# EAGLE design Shield (EAGLE 7.2.0)
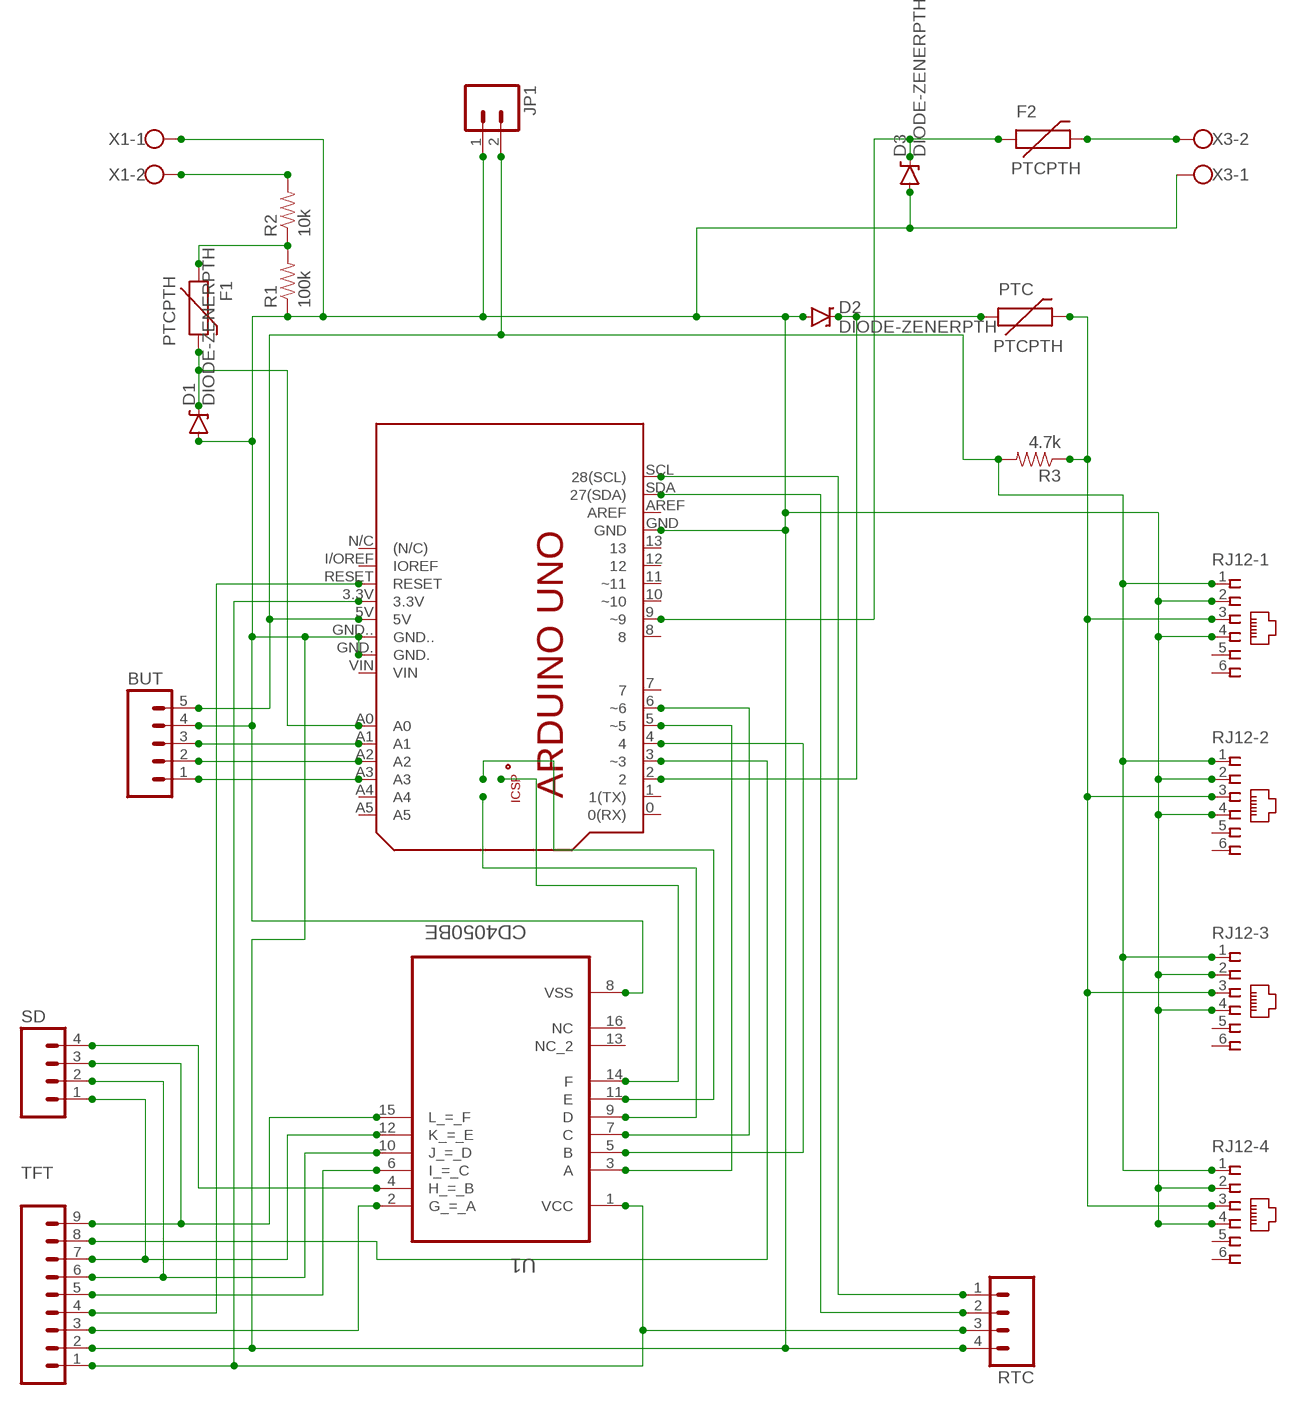
[diagram p0: schematic, sheet 1]

## Parts
BUT  M05PTH_LONGPADS  [1X05_LONGPADS]
D1  DIODE-ZENERPTH  [DIODE-ZENER]
D2  DIODE-ZENERPTH  [DIODE-ZENER]
D3  DIODE-ZENERPTH  [DIODE-ZENER]
F1  PTCPTH  [PTC]
F2  PTCPTH  [PTC]
JP1  M023.5MM  [SCREWTERMINAL-3.5MM-2]
PCB1  ARDUINO_UNO  [ARDUINO_UNO]
PTC  PTCPTH  [PTC]
R1  100k  RESISTORAXIAL-0.3  [AXIAL-0.3]
R2  10k  RESISTORAXIAL-0.3  [AXIAL-0.3]
R3  4.7k  RESISTORAXIAL-0.3  [AXIAL-0.3]
RJ12-1  555165-1  [555165-1]
RJ12-2  555165-1  [555165-1]
RJ12-3  555165-1  [555165-1]
RJ12-4  555165-1  [555165-1]
RTC  M04LONGPADS  [1X04_LONGPADS]
SD  M04LONGPADS  [1X04_LONGPADS]
TFT  M09LONGPADS  [1X09_LONGPADS]
U1  CD4050BE  [DIP254P762X508-16]
X1  W237-102  [W237-102]
X3  W237-102  [W237-102]

## Nets
GND: BUT.4 D1.P$2(A) D2.P$2(A) D3.P$2(A) JP1.1 PCB1.GND PCB1.GND. PCB1.GND.. R1.P$1 RJ12-1.2 RJ12-1.4 RJ12-2.2 RJ12-2.4 RJ12-3.2 RJ12-3.4 RJ12-4.2 RJ12-4.4 RTC.4 TFT.2 U1.8(VSS) X1.1 X3.1
N$1: BUT.3 PCB1.A1
N$2: PTC.P$2 R3.P$1 RJ12-1.3 RJ12-2.3 RJ12-3.3 RJ12-4.3
N$3: PCB1.3.3V RTC.3 TFT.1 U1.1(VCC)
N$4: D2.P$1(C) PCB1.2 PTC.P$1
N$5: PCB1.RESET TFT.4
N$6: SD.4 U1.4(H_=_B)
N$7: PCB1.5(~5) U1.3(A)
N$8: PCB1.6(~6) U1.7(C)
N$9: PCB1.MOSI U1.9(D)
N$10: TFT.3 U1.2(G_=_A)
N$11: TFT.5 U1.6(I_=_C)
N$12: SD.2 TFT.6 U1.10(J_=_D)
N$13: PCB1.3(~3) TFT.8
N$14: SD.1 TFT.7 U1.12(K_=_E)
N$15: SD.3 TFT.9 U1.15(L_=_F)
N$16: PCB1.SCK U1.11(E)
N$17: PCB1.MISO U1.14(F)
N$18: BUT.5 JP1.2 PCB1.5V R3.P$2 RJ12-1.1 RJ12-2.1 RJ12-3.1 RJ12-4.1
N$19: BUT.2 PCB1.A2
N$20: PCB1.4 U1.5(B)
N$21: BUT.1 PCB1.A3
N$22: PCB1.SDA(27(SDA)) RTC.2
N$23: PCB1.SCL(28(SCL)) RTC.1
N$24: F1.P$1 R1.P$2 R2.P$1
N$25: D1.P$1(C) F1.P$2 PCB1.A0
N$26: R2.P$2 X1.2
N$27: F2.P$2 X3.2
N$28: D3.P$1(C) F2.P$1 PCB1.9(~9)
Unconnected: PCB1.0(0(RX)) PCB1.1(1(TX)) PCB1.7 PCB1.8 PCB1.10(~10) PCB1.11(~11) PCB1.12 PCB1.13 PCB1.+5V PCB1.A4 PCB1.A5 PCB1.AREF PCB1.GND_ PCB1.I/OREF(IOREF) PCB1.N/C((N/C)) PCB1.RESET. PCB1.VIN RJ12-1.5 RJ12-1.6 RJ12-2.5 RJ12-2.6 RJ12-3.5 RJ12-3.6 RJ12-4.5 RJ12-4.6 U1.13(NC_2) U1.16(NC)

## Library data of the parts
BUT = SparkFun-Connectors:M05: Header 5 Standard 5-pin 0.1" header. Use with straight break away headers (SKU : PRT-00116), right angle break away headers (PRT-00553), swiss pins (PRT-00743), machine pins (PRT-00117), and female headers (PRT-00115). Molex polarized connector foot print use with SKU : PRT-08230 with associated crimp pins and housings.
D1-D3 = SparkFun-DiscreteSemi:DIODE-ZENER: Zener Diode Production Part - 8199 3.4V Zener Voltage
F1 F2 PTC = SparkFun-PowerIC:PTC: Resettable Fuse PTC Resettable Fuse. Spark Fun Electronics SKU : COM-08357
JP1 = SparkFun-Connectors:M02: Standard 2-pin 0.1" header. Use with - straight break away headers ( PRT-00116) - right angle break away headers (PRT-00553) - swiss pins (PRT-00743) - machine pins (PRT-00117) - female headers (PRT-00115) Molex polarized connector foot print use with: PRT-08233 with associated crimp pins and housings. 2.54_SCREWTERM for use with PRT-10571. 3.5mm Screw Terminal footprints for PRT-08084 5mm Screw Terminal footprints for use with PRT-08432; PROD_ID: CONN-08399
PCB1 = BensCustomLib:ARDUINO_UNO: Device for representing an Arduino Uno board with a footprint in an EAGLE design. Created by Dave Young for Element14. More EAGLE documentation at: http://www.element14.com/community/community/knode/cadsoft_eagle
R1-R3 = SparkFun-Resistors:RESISTOR: Resistor Basic schematic elements and footprints for 0603, 1206, and PTH resistors.
RJ12-1-RJ12-4 = BensCustomLib:555165-1: AMP connector
RTC SD = SparkFun-Connectors:M04: Header 4 Standard 4-pin 0.1" header. Use with straight break away headers (SKU : PRT-00116), right angle break away headers (PRT-00553), swiss pins (PRT-00743), machine pins (PRT-00117), and female headers (PRT-00115). Molex polarized connector foot print use with SKU : PRT-08231 with associated crimp pins and housings. 1MM SMD Version SKU: PRT-10208
TFT = SparkFun-Connectors:M09: Header 9 Standard 9-pin 0.1" header. Use with straight break away headers (SKU : PRT-00116), right angle break away headers (PRT-00553), swiss pins (PRT-00743), machine pins (PRT-00117), and female headers (PRT-00115).
U1 = BensCustomLib:CD4050BE: CMOS Hex Buffer/Converters; MPN: CD4050BE; OC_FARNELL: 1106108; OC_NEWARK: 60K5118; PACKAGE: PDIP-16; SUPPLIER: Texas Instruments
X1 X3 = con-wago-500:W237-102: WAGO SCREW CLAMP; MPN: 237-102; OC_FARNELL: unknown; OC_NEWARK: 70K9898

## Net classes
0 default: clearance 0.205 mm

## Board
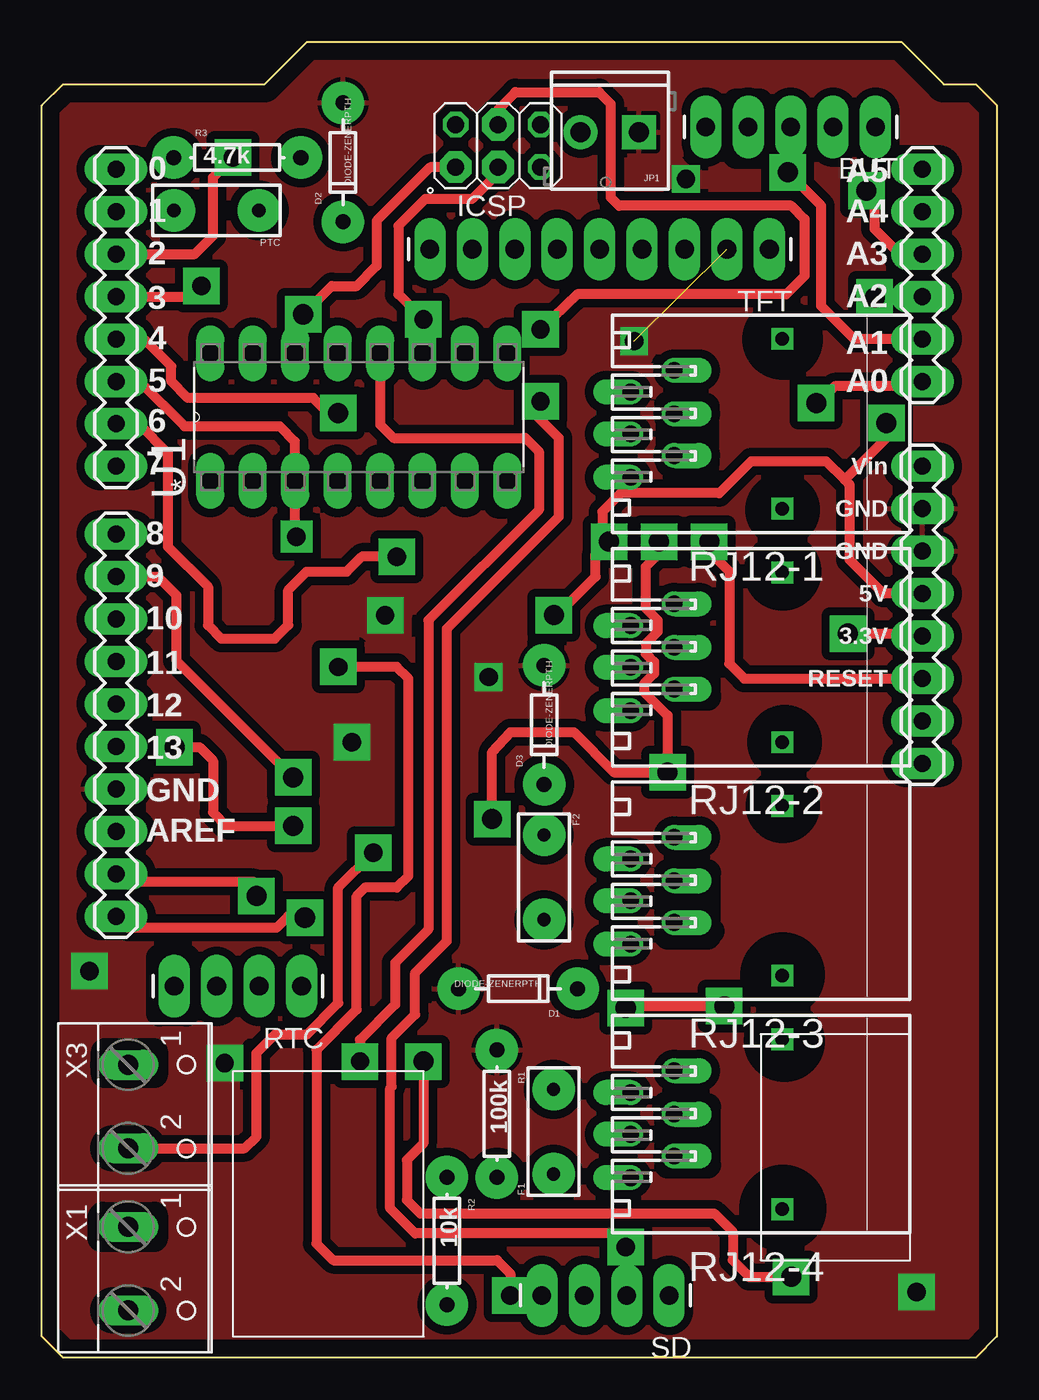
[diagram p1: board, top side]
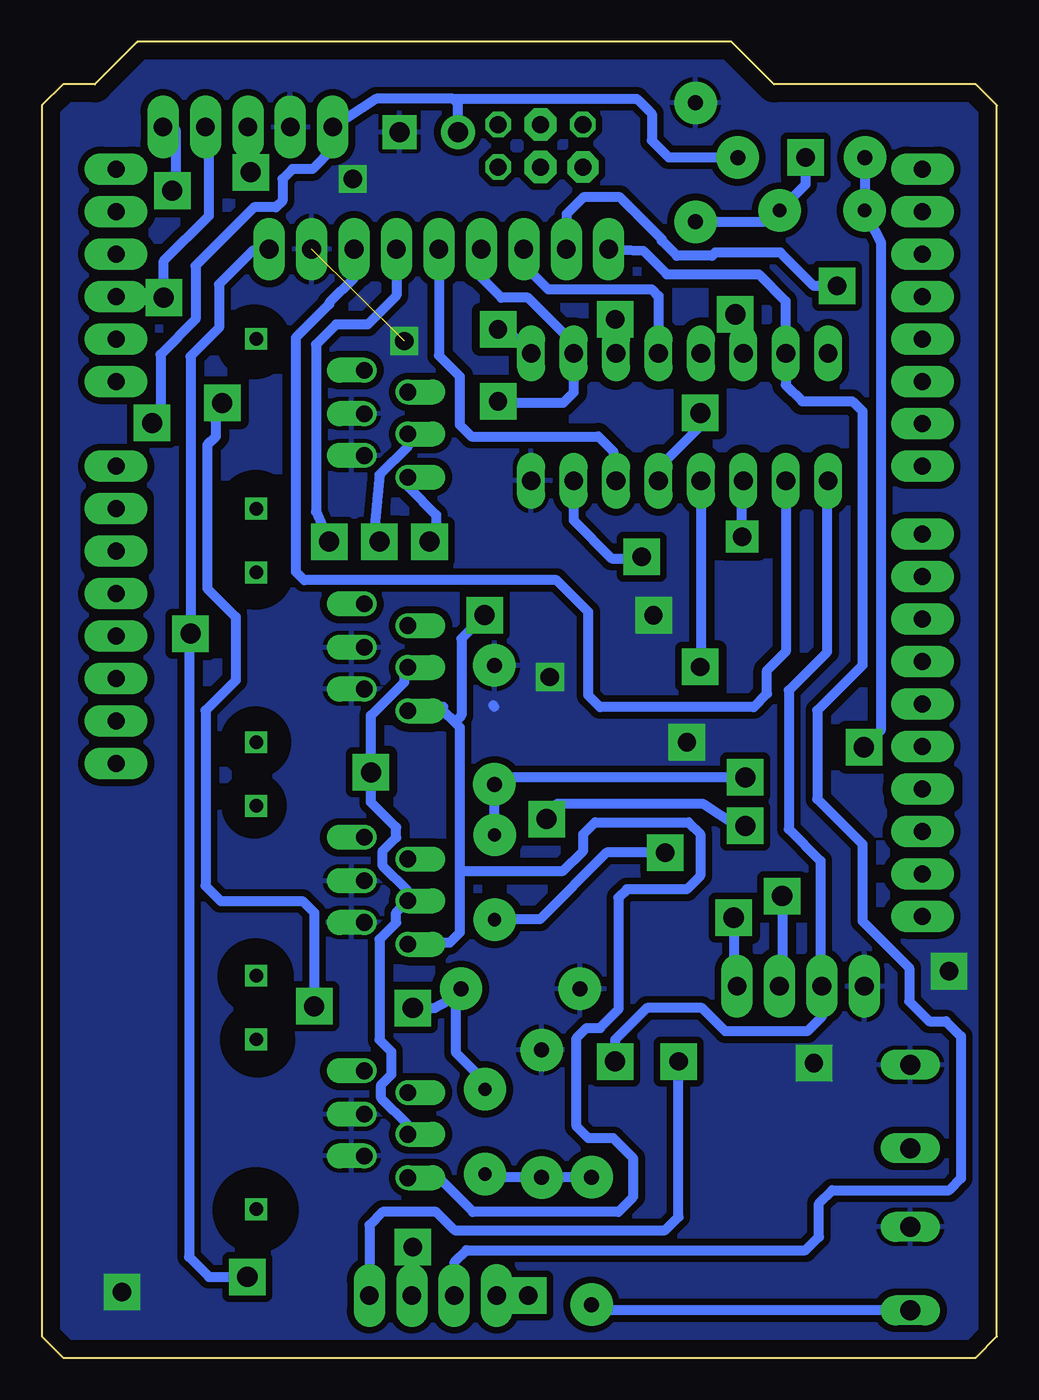
[diagram p2: board, bottom side, seen from below]

Size 57.15 x 78.74 mm. Coordinates in mm from the lower left corner, seen from the top.
Copper layers (1*16): Top 0.07mm / dielectric 1.5mm / Bottom 0.07mm
Design rules "default *": minimum track width 10mil, minimum drill 24mil, track to track 8mil, track to pad 8mil, pad to pad 8mil, via to via 8mil, smd to smd 8mil, copper to edge 40mil, drill to drill 8mil, minimum pad ring 10mil, minimum via ring 8mil, stop-mask expansion 4mil, vias tented up to drill 0mil, thermal gap 10mil
tRestrict: area 42.6,59.2 to 46,62.6; area 42.8,49.2 to 45.9,52.3; area 42.7,45.4 to 46,48.6; area 42.9,35.3 to 46,38.4; area 42.8,31.5 to 45.9,34.5; area 42.5,21.1 to 46.2,24.8; area 42.7,17.2 to 46.2,20.7; area 42.4,7 to 46.2,10.8; area 40.3,64.7 to 41.5,68.1; area 27.2,51 to 28.4,54; area 3.7,16.9 to 6.7,18.3; area 3.5,7.1 to 6.7,8.5; area 37.3,11.5 to 39.8,15.1; area 37.4,25.2 to 40,29; area 37.4,39.5 to 39.8,43.1; area 37.4,53.5 to 39.7,57; area 7,20.6 to 8.6,23.9; area 41.5,71.9 to 42.9,75.1
bRestrict: area 42.8,49.2 to 45.9,52.4; area 42.7,45.4 to 46,48.7; area 42.8,35.3 to 45.9,38.4; area 43.1,31.7 to 45.8,34.4; area 42.7,21.2 to 46,24.5; area 42.6,17.4 to 45.9,20.7; area 42.9,59.2 to 46,62.4; area 42.5,7 to 46.2,10.7; area 51.1,47.4 to 54.1,51.5; area 2.7,33.3 to 5.9,34.7

### Footprints (pad centres in the part's own frame; a part is rotated, then mirrored left to right if it is on the bottom)
1X05_LONGPADS = drill 1.118 pad 1.88 long: 1 0,0; 2 2.54,0; 3 5.08,0; 4 7.62,0; 5 10.16,0
DIODE-ZENER = drill 0.9 pad 2.54: P$1 -3.556,0; P$2 3.556,0
PTC = drill 0.8 pad 2.54: P$1 -2.54,0; P$2 2.54,0
SCREWTERMINAL-3.5MM-2 = drill 1.2 pad 2.032 square: 1 0,0 | drill 1.2 pad 2.032: 2 3.5,0
ARDUINO_UNO = drill 1.016 pad 1.88 long: 0 63.5,50.8; 1 60.96,50.8; 2 58.42,50.8; 3 55.88,50.8; 3.3V 35.56,2.54; 4 53.34,50.8; 5 50.8,50.8; 5V 38.1,2.54; 6 48.26,50.8; 7 45.72,50.8; 8 41.656,50.8; 9 39.116,50.8; 10 36.576,50.8; 11 34.036,50.8; 12 31.496,50.8; 13 28.956,50.8; A0 50.8,2.54; A1 53.34,2.54; A2 55.88,2.54; A3 58.42,2.54; A4 60.96,2.54; A5 63.5,2.54; AREF 23.876,50.8; GND 26.416,50.8; GND. 43.18,2.54; GND.. 40.64,2.54; I/OREF 30.48,2.54; N/C 27.94,2.54; RESET 33.02,2.54; SCL 18.796,50.8; SDA 21.336,50.8; VIN 45.72,2.54 | drill 1.016 pad 1.422 octagon: +5V 66.167,30.48; GND_ 66.167,25.4; RESET. 63.627,25.4 | drill 1.016 pad 1.88 octagon: MISO 63.627,30.48 | drill 1.016 pad 1.93 octagon: MOSI 66.167,27.94; SCK 63.627,27.94
AXIAL-0.3 = drill 0.9 pad 2.54: P$1 -3.81,0; P$2 3.81,0
555165-1 = drill 1 offset: 1 -3.2,7.8; 2 -1.9,5.2; 3 -0.6,7.8; 4 0.6,5.2; 5 1.9,7.8; 6 3.2,5.2 | drill 0.8 square: P$1 -5.08,-1.27; P$2 5.08,-1.27
1X04_LONGPADS = drill 1.118 pad 1.88 long: 1 0,0; 2 2.54,0; 3 5.08,0; 4 7.62,0
1X09_LONGPADS = drill 1.118 pad 1.88 long: 1 0,0; 2 2.54,0; 3 5.08,0; 4 7.62,0; 5 10.16,0; 6 12.7,0; 7 15.24,0; 8 17.78,0; 9 20.32,0
DIP254P762X508-16 = drill 1.118 long: 1 -7.62,17.78; 2 -7.62,15.24; 3 -7.62,12.7; 4 -7.62,10.16; 5 -7.62,7.62; 6 -7.62,5.08; 7 -7.62,2.54; 8 -7.62,0; 9 0,0; 10 0,2.54; 11 0,5.08; 12 0,7.62; 13 0,10.16; 14 0,12.7; 15 0,15.24; 16 0,17.78
W237-102 = drill 1.194 long: 1 -2.5,-1.27; 2 2.5,-1.27

### Placement (x,y rotation side)
BUT  49.9,73.64 180 top
D1  28.5,22.07 180 top
D2  18.02,71.53 90 top
D3  30.07,37.87 90 top
F1  30.62,13.52 90 top
F2  30.05,28.74 270 top
JP1  35.74,73.33 180 top
PCB1  55.24,7.62 90 top
PTC  10.46,68.65 180 top
R1  27.23,14.6 270 top
R2  24.25,6.99 270 top
R3  11.7,71.81 0 top
RJ12-1  43.05,55.88 90 top
RJ12-2  43.05,41.91 90 top
RJ12-3  43.05,27.94 90 top
RJ12-4  43.05,13.97 90 top
RTC  15.55,22.23 180 top
SD  37.55,3.73 180 top
TFT  43.55,66.33 180 top
U1  27.87,60.09 90 top
X1  6.45,5.33 270 top
X3  6.45,15.03 270 top

### Tracks (layer width: path | path; a pad name or v marks a point on that pad's centre or on a via)
GND  (via drill 1.1 pad 0.61, 1.1 pad 1.68, 1.1 pad 2.18)  (1 unrouted)
  Bottom 0.61: 30.07,38.95 30.14,39.03
  other vias: 18.55,36.83 20.55,44.43 10.95,17.63 2.85,23.13 52.34,3.93 38.55,70.53 35.45,60.83 26.75,40.73
  pour Bottom (isolate 0.4): -0.15,1.43 -0.15,74.43 1.15,76.23 13.45,76.13 15.84,78.73 51.65,78.93 54.24,75.93 55.95,76.23 57.05,73.63 57.24,1.43 55.95,-0.07 1.25,-0.27
  pour Top (isolate 0.7): -0.05,1.23 -0.05,74.83 1.25,76.23 13.45,76.13 15.95,78.83 51.55,78.83 53.95,76.33 57.15,74.93 57.15,1.43 55.74,-0.07 1.55,-0.17
N$1  (via drill 1.2 pad 2.18)
  Top 0.61: PCB1.A1 48.62,60.96 46.65,62.93 46.65,68.93 v44.65,70.93
  Bottom 0.61: BUT.3 44.81,71.1 v44.65,70.93
N$2  (via drill 1.2 pad 2.18)
  Top 0.61: v7.95,36.53 9.45,36.53 10.25,35.73 10.25,32.63 11.04,31.83 v15.04,31.83 | v26.95,32.23 26.95,36.23 28.05,37.43 31.84,37.43 34.24,35.03 v37.45,35.03 37.45,38.43 36.05,39.83 36.05,40.33 36.65,40.93 36.65,41.63 36.15,42.13 36.15,42.73 36.84,43.43 36.84,44.13 36.15,44.83 36.15,47.33 36.84,48.03 36.84,48.63 v36.95,48.83
  Bottom 0.61: R3.P$1 7.88,69.18 PTC.P$2 6.95,66.78 6.95,37.53 v7.95,36.53 | RJ12-1.3 35.24,54.53 36.95,52.83 37.24,49.73 v36.95,48.83 | RJ12-2.3 35.45,41.11 35.45,40.43 37.45,38.43 v37.45,35.03 37.45,33.23 35.95,31.73 35.95,31.13 36.74,30.33 36.74,29.43 35.24,27.93 RJ12-3.3 35.95,26.64 35.95,26.03 36.95,25.03 36.95,19.03 36.24,18.33 36.24,16.93 36.84,16.33 36.84,15.53 35.24,13.93 RJ12-4.3 | v15.04,31.83 15.55,31.83 17.55,33.13 26.34,33.13 v26.95,32.23
N$3  (via drill 1.2 pad 2.18)
  Top 0.61: 52.66,43.23 PCB1.3.3V 52.55,43.33 v48.24,43.33 | v22.84,17.73 22.84,12.83 21.84,11.83 21.84,9.43 22.64,8.63 40.24,8.63 41.34,7.53 41.34,5.83 42.34,4.83 v44.84,4.83
  Bottom 0.61: 10.45,22.25 RTC.3 | TFT.1 44.55,66.23 46.55,64.23 46.55,61.63 48.24,59.93 v48.24,43.33 48.34,43.23 48.34,6.03 47.15,4.83 v44.84,4.83 | RTC.3 10.54,22.31 10.54,29.73 12.45,31.63 12.45,39.93 10.14,42.23 10.14,52.41 U1.1 | RTC.3 10.45,22.21 10.45,20.43 11.35,19.53 16.25,19.53 17.64,20.93 20.95,20.93 22.84,19.03 v22.84,17.73 22.84,18.33
N$4  (via drill 1.1 pad 2.18)
  Top 0.61: PCB1.2 9.16,66.04 10.25,67.13 10.25,70.63 v11.45,71.83
  Bottom 0.61: D2.P$1 13.97,67.97 PTC.P$1 11.45,70.2 v11.45,71.83
N$5  (via drill 1.2 pad 2.18)
  Top 0.61: v39.95,48.83 39.24,48.93 41.15,47.03 41.15,41.53 42.05,40.63 PCB1.RESET
  Bottom 0.61: TFT.4 35.92,63.55 37.65,61.83 39.55,61.83 40.74,60.63 40.74,50.63 v39.95,48.83
N$6  (via drill 1.1 pad 2.18)
  Top 0.61: v28.05,3.73 28.05,5.03 27.25,5.83 17.45,5.83 16.45,6.83 16.45,18.43 18.84,20.83 18.84,27.63 19.34,28.13 21.25,28.13 21.95,28.83 21.95,40.63 21.25,41.33 v17.75,41.33
  Bottom 0.61: U1.4 17.71,41.37 v17.75,41.33 | v28.05,3.73 SD.4
N$7  (via drill 1.1 pad 1.93)
  Top 0.61: PCB1.5 5.86,58.42 8.54,55.73 14.25,55.73 15.14,54.83 15.14,49.23 v15.25,49.13
  Bottom 0.61: v15.25,49.13 15.25,52.39 U1.3
N$8  (via drill 1.1 pad 2.18)
  Top 0.61: PCB1.6 5.79,55.88 7.54,54.13 7.54,48.53 9.95,46.13 9.95,43.83 10.75,43.03 13.95,43.03 14.75,43.83 14.75,45.93 15.84,47.03 18.25,47.03 19.14,47.93 v21.25,47.93
  Bottom 0.61: 25.34,52.45 U1.7 25.32,50.11 23.05,47.83 21.34,47.83 v21.25,47.93
N$9  (via drill 1.1 pad 2.18)
  Top 0.61: PCB1.MOSI 27.3,74.69 28.34,75.73 33.34,75.73 34.05,75.03 34.05,69.43 34.55,68.93 44.84,68.93 45.65,68.13 45.65,64.73 44.55,63.63 32.05,63.63 v29.84,61.53
  Bottom 0.61: v29.84,61.53 29.21,61.43 U1.9
N$10
  Bottom 0.61: TFT.3 38.47,64.61 39.95,63.13 39.95,63.03 41.95,61.03 41.95,47.03 41.45,46.53 26.34,46.53 24.45,44.63 24.45,39.63 23.75,38.93 14.54,38.93 13.75,39.73 13.75,41.13 12.62,42.25 U1.2
N$11
  Bottom 0.61: 22.84,52.53 U1.6 22.95,52.63 22.95,54.23 23.84,55.13 31.45,55.13 32.15,55.83 32.15,58.73 33.38,59.97 TFT.5
N$12  (via drill 1.1 pad 2.18)
  Top 0.61: 29.95,57.23 v29.84,57.23 29.75,57.13 29.75,56.23 30.95,55.03 30.95,50.33 24.25,43.63 24.25,24.93 22.34,23.03 22.34,20.53 20.95,19.13 20.95,16.23 20.84,16.13 20.84,8.93 22.34,7.43 34.15,7.43 v34.95,6.63
  Bottom 0.61: TFT.6 30.84,64.63 29.64,63.43 28.05,63.43 25.45,60.83 25.45,60.21 U1.10 25.32,57.75 25.95,57.13 29.75,57.13 v29.84,57.23 | v34.95,6.63 34.95,3.79 SD.2
N$13  (via drill 1.1 pad 2.18)
  Top 0.61: PCB1.3 8.92,63.5 v9.54,64.13
  Bottom 0.61: v9.54,64.13 10.95,64.13 12.95,66.13 16.84,66.13 17.05,65.93 19.14,65.93 20.05,66.83 20.05,66.93 22.55,69.43 24.75,69.43 25.75,68.43 25.75,66.35 TFT.8
N$14  (via drill 1.1 pad 2.18)
  Top 0.61: U1.12 20.25,55.83 21.05,55.03 28.95,55.03 29.75,54.23 29.75,50.73 23.14,44.13 23.14,25.63 21.14,23.63 21.14,21.13 19.05,19.03 v19.05,17.73
  Bottom 0.61: TFT.7 28.14,66.07 28.14,65.23 26.84,63.93 20.64,63.93 20.25,63.53 U1.12 | SD.1 37.55,7.93 36.74,8.73 33.55,8.73 32.45,7.63 19.84,7.63 19.05,8.43 v19.05,17.73
N$15
  Bottom 0.61: TFT.9 21.14,66.23 19.75,64.83 14.25,64.83 12.64,63.23 12.64,60.11 U1.15 12.62,58.21 11.64,57.23 8.64,57.23 8.04,56.63 8.04,41.43 10.75,38.73 10.75,33.43 8.04,30.73 8.04,26.13 5.25,23.33 5.25,21.33 4.04,20.13 3.05,20.13 2.15,19.23 2.15,10.73 2.85,10.03 9.85,10.03 10.64,9.23 10.64,7.23 11.45,6.43 31.74,6.43 32.45,5.73 32.45,3.75 SD.3
N$16  (via drill 1.1 pad 2.18)
  Top 0.61: PCB1.SCK 27.3,70.89 25.75,69.33 22.95,69.33 21.34,67.73 21.34,63.63 v22.84,62.13
  Bottom 0.61: v22.84,62.13 22.84,60.15 U1.11
N$17  (via drill 1.2 pad 2.18)
  Top 0.61: v15.64,62.43 17.34,64.13 18.84,64.13 20.05,65.33 20.05,68.03 23.25,71.23 24.75,71.23 PCB1.MISO
  Bottom 0.61: U1.14 15.17,61.65 v15.64,62.43
N$18  (via drill 1.2 pad 2.18)
  Top 0.61: PCB1.5V 50.35,45.72 48.34,47.73 48.34,52.23 48.05,52.53 | 48.05,52.53 46.95,53.63 42.45,53.63 40.55,51.73 34.65,51.73 33.55,50.63 33.55,49.13 v33.95,48.83 33.15,48.13 33.15,46.73 30.84,44.43 v30.64,44.43 | v50.55,55.93 50.55,55.03 48.05,52.53
  Bottom 0.61: 32.55,75.33 21.55,75.33 20.64,74.43 20.64,72.83 19.64,71.83 15.59,71.83 R3.P$2 | RJ12-3.1 35.16,24.83 32.74,24.83 32.15,25.43 32.15,29.13 | RJ12-2.1 33.12,38.71 | 33.12,38.71 32.45,38.03 | 32.45,38.03 32.15,37.73 32.15,29.13 | 33.12,38.71 33.12,38.97 | 34.01,10.77 RJ12-4.1 35.19,10.83 33.45,10.83 31.34,8.73 22.64,8.73 21.75,9.63 21.75,11.93 22.95,13.13 24.45,13.13 25.14,13.83 25.14,19.13 24.55,19.73 23.75,19.73 22.64,20.83 22.64,27.53 22.14,28.03 18.55,28.03 17.75,28.83 17.75,31.33 18.45,32.03 24.05,32.03 24.75,31.33 24.75,30.33 25.95,29.13 32.15,29.13 | v50.55,55.93 50.05,56.53 50.05,60.03 47.95,62.13 47.95,65.33 44.45,68.83 43.15,68.83 42.74,69.23 42.74,70.53 42.15,71.13 40.95,71.13 39.73,72.34 BUT.5 37.15,75.33 32.55,75.33 | v30.64,44.43 32.05,43.03 32.05,38.43 32.45,38.03 | JP1.2 32.24,75.03 32.55,75.33 | RJ12-1.1 35.24,52.13 33.55,50.43 33.55,49.23 v33.95,48.83
N$19  (via drill 1.2 pad 2.18)
  Top 0.61: PCB1.A2 49.91,63.5 v49.84,63.43
  Bottom 0.61: v49.84,63.43 49.84,65.63 47.15,68.33 47.15,73.43 BUT.2
N$20  (via drill 1.2 pad 2.18)
  Top 0.61: PCB1.4 4.58,60.83 6.25,60.83 7.75,59.33 7.75,58.43 8.75,57.43 16.25,57.43 17.14,56.53 v17.75,56.53
  Bottom 0.61: U1.5 20.25,53.23 17.64,55.83 17.64,56.43 v17.75,56.53
N$21  (via drill 1.2 pad 2.18)
  Top 0.61: PCB1.A3 51.34,66.04 49.84,67.53 49.84,69.13 v49.34,69.83
  Bottom 0.61: BUT.1 49.15,73.49 49.15,70.03 v49.34,69.83
N$22  (via drill 1.2 pad 2.18)
  Top 0.61: v12.85,27.63 12.72,28.46 4.95,28.46 PCB1.SDA
  Bottom 0.61: v12.85,27.63 12.85,22.39 RTC.2
N$23  (via drill 1.2 pad 2.18)
  Top 0.61: v15.75,26.33 15.56,26.42 14.73,26.42 14.04,25.73 5.13,25.73 PCB1.SCL
  Bottom 0.61: v15.75,26.33 15.75,22.43 RTC.1
N$24
  Bottom 0.61: R2.P$1 26.84,10.8 R1.P$2 30.43,10.79 F1.P$1
N$25  (via drill 1.2 pad 2.18)
  Top 0.61: PCB1.A0 52.41,58.13 47.45,58.13 46.74,57.43 46.65,57.43 v46.34,57.13 | v40.84,21.03 36.05,21.03 v34.95,20.93
  Bottom 0.61: F1.P$2 30.62,16.51 32.34,18.23 32.34,21.63 | 32.34,21.63 32.34,21.79 D1.P$1 | v46.34,57.13 46.74,57.43 46.74,55.13 47.24,54.63 47.24,46.03 45.55,44.33 45.55,40.53 47.34,38.73 47.34,28.23 46.45,27.33 41.55,27.33 40.84,26.63 v40.84,21.03 | v34.95,20.93 33.65,20.93 32.34,21.63
N$26
  Bottom 0.61: X1.2 23.89,2.83 R2.P$2
N$27  (via drill 1.1 pad 2.18)
  Top 0.61: X3.2 12.14,12.53 12.85,13.23 12.85,18.23 13.95,19.33 15.84,19.33 17.75,21.23 17.75,28.13 v19.84,30.23 19.75,30.13
  Bottom 0.61: v19.84,30.23 23.34,30.23 27.34,26.23 30.02,26.23 F2.P$2
N$28  (via drill 1.2 pad 2.18)
  Top 0.61: 14.45,34.93 v15.04,34.73 8.04,41.73 8.04,45.63 6.94,46.74 PCB1.9
  Bottom 0.61: F2.P$1 30.05,34.9 D3.P$1 29.88,34.73 v15.04,34.73
N$29
  pour Bottom (isolate 0.5): 0.05,1.23 -0.05,74.63 1.25,76.13 13.45,76.23 15.95,78.73 51.55,78.93 54.15,76.03 56.05,76.33 57.15,75.13 57.24,1.43 56.05,-0.07 1.35,-0.07
N$30
  pour Top (isolate 0.5): -0.05,1.33 -0.05,74.73 1.25,76.13 13.35,76.23 15.95,78.83 51.65,78.83 53.95,76.13 55.84,76.23 57.15,74.93 57.15,1.23 55.24,-0.17 1.35,-0.17